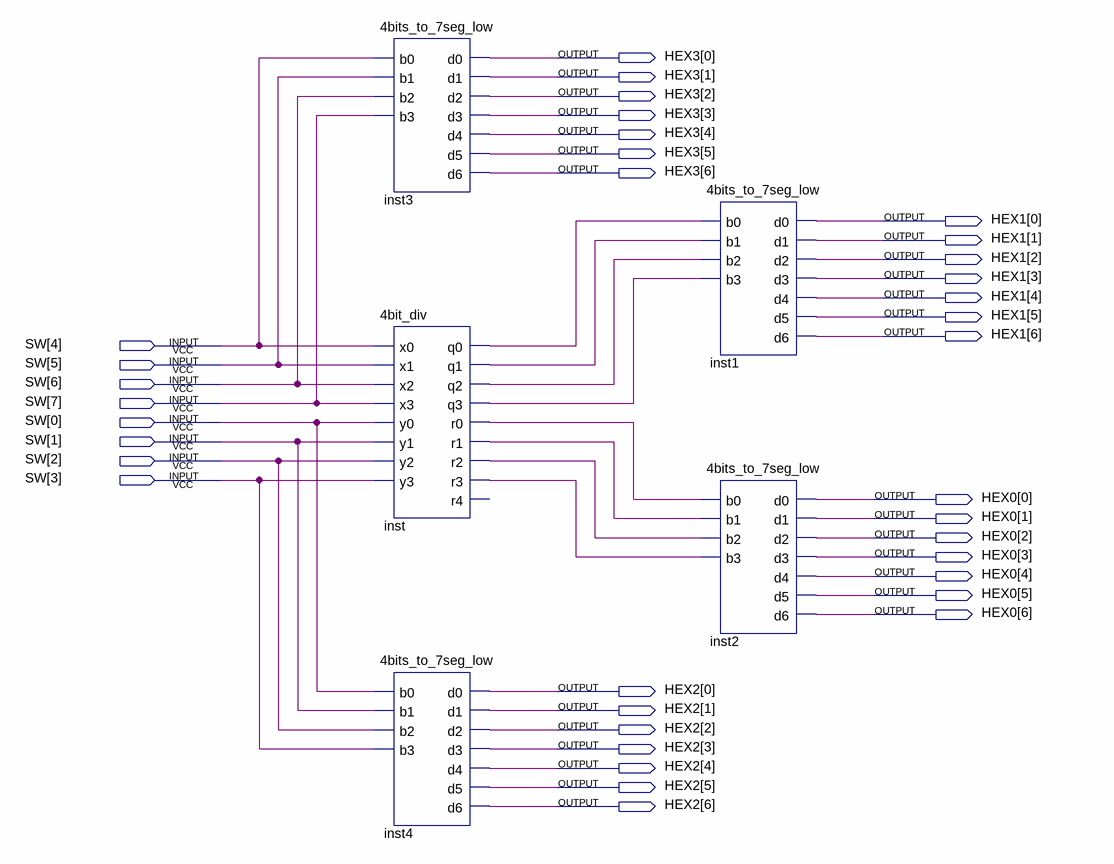
[diagram p0: schematic sheet]
// Quartus schematic main.bdf as structural Verilog: 5 symbols, 36 pins
module main (
  input  [7:0] SW,
  output [6:0] HEX3,
  output [6:0] HEX1,
  output [6:0] HEX0,
  output [6:0] HEX2
);

  wire inst_q0, inst_q1, inst_q2, inst_q3, inst_r0, inst_r1, inst_r2, inst_r3;

  \4bits_to_7seg_low  inst3 (
    .b0(SW[4]), .b1(SW[5]), .b2(SW[6]), .b3(SW[7]), .d0(HEX3[0]), .d1(HEX3[1]), .d2(HEX3[2]), .d3(HEX3[3]),
    .d4(HEX3[4]), .d5(HEX3[5]), .d6(HEX3[6]));
  \4bit_div  inst (
    .x0(SW[4]), .x1(SW[5]), .x2(SW[6]), .x3(SW[7]), .y0(SW[0]), .y1(SW[1]), .y2(SW[2]), .y3(SW[3]),
    .q0(inst_q0), .q1(inst_q1), .q2(inst_q2), .q3(inst_q3), .r0(inst_r0), .r1(inst_r1), .r2(inst_r2),
    .r3(inst_r3));  // open: r4
  \4bits_to_7seg_low  inst4 (
    .b0(SW[0]), .b1(SW[1]), .b2(SW[2]), .b3(SW[3]), .d0(HEX2[0]), .d1(HEX2[1]), .d2(HEX2[2]), .d3(HEX2[3]),
    .d4(HEX2[4]), .d5(HEX2[5]), .d6(HEX2[6]));
  \4bits_to_7seg_low  inst1 (
    .b0(inst_q0), .b1(inst_q1), .b2(inst_q2), .b3(inst_q3), .d0(HEX1[0]), .d1(HEX1[1]), .d2(HEX1[2]),
    .d3(HEX1[3]), .d4(HEX1[4]), .d5(HEX1[5]), .d6(HEX1[6]));
  \4bits_to_7seg_low  inst2 (
    .b0(inst_r0), .b1(inst_r1), .b2(inst_r2), .b3(inst_r3), .d0(HEX0[0]), .d1(HEX0[1]), .d2(HEX0[2]),
    .d3(HEX0[3]), .d4(HEX0[4]), .d5(HEX0[5]), .d6(HEX0[6]));
endmodule
